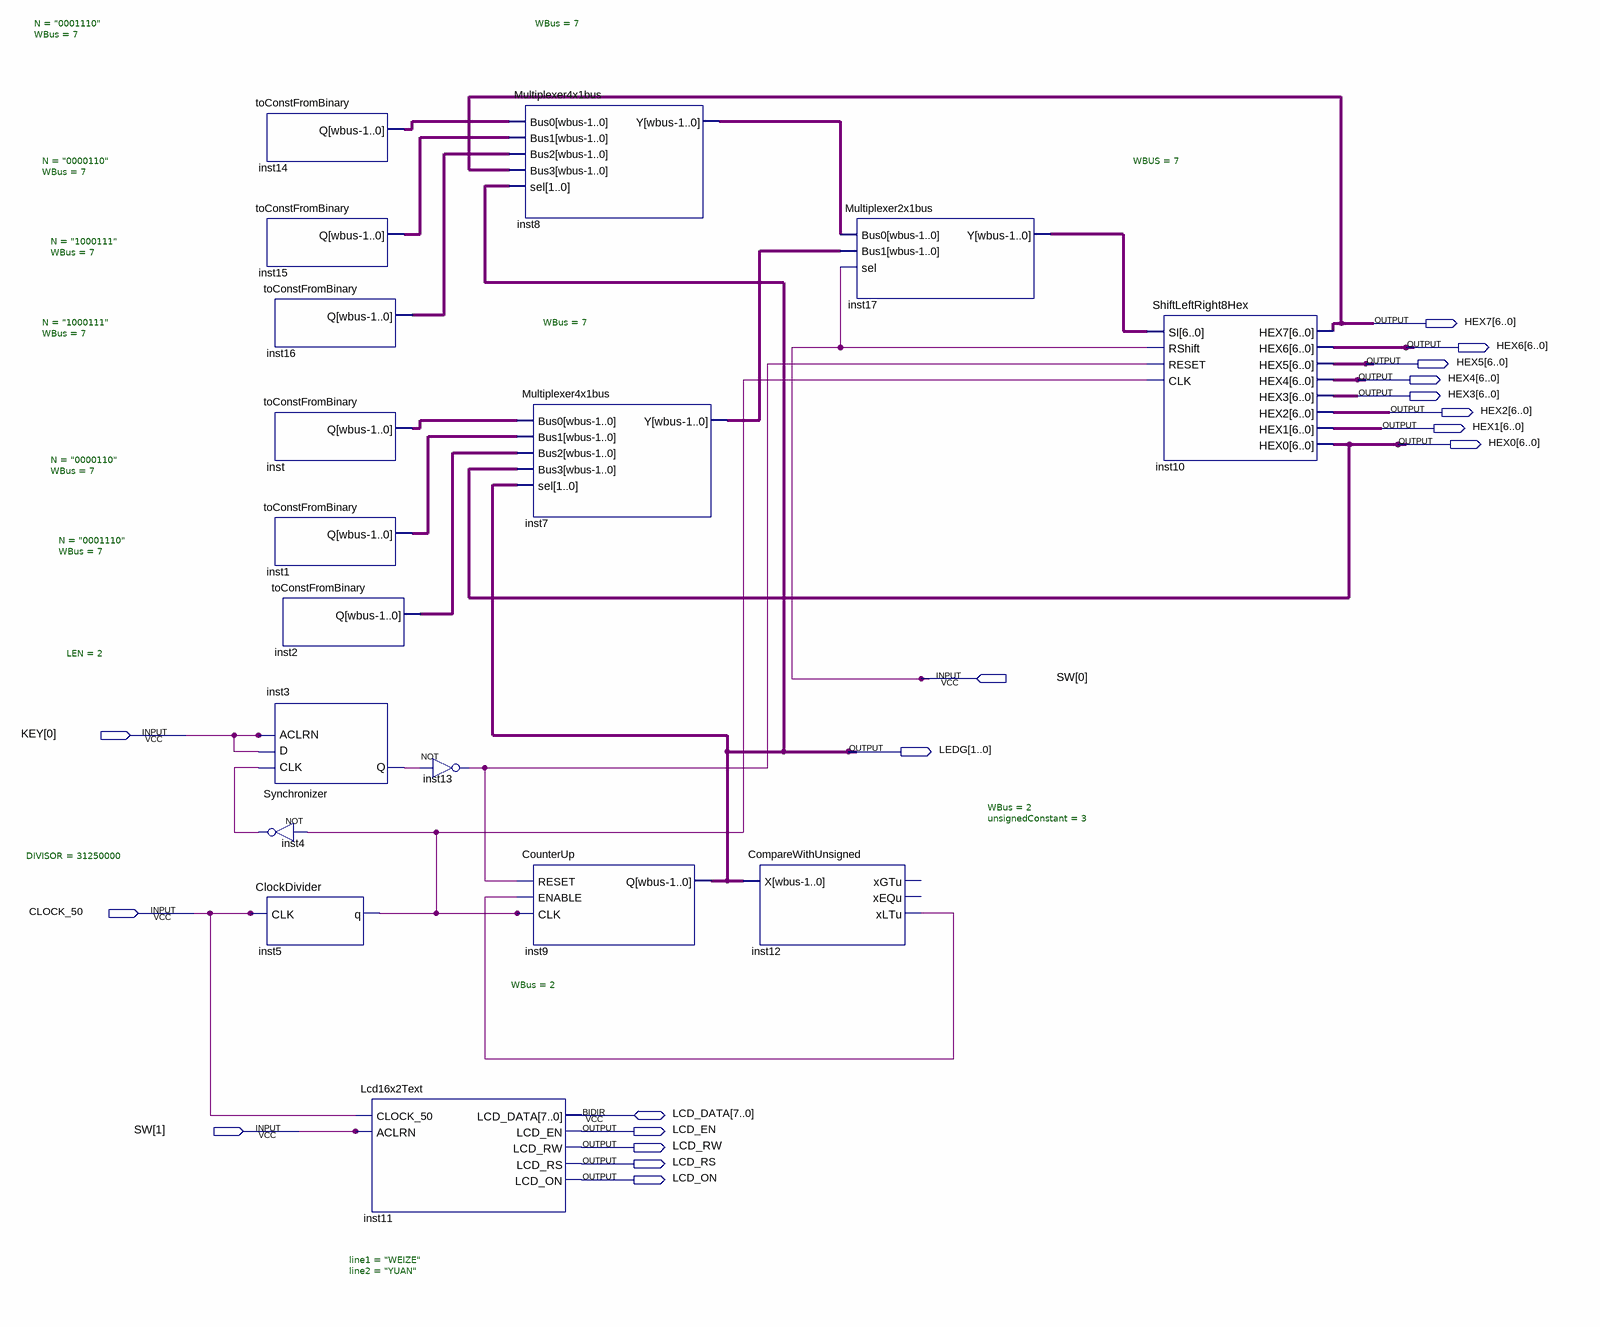
[diagram p0: schematic sheet]
// Quartus schematic mscd.bdf as structural Verilog: 17 symbols, 18 pins
module mscd (
  input  [1:0] SW,
  input  [0:0] KEY,
  input  CLOCK_50,
  inout  [7:0] LCD_DATA,
  output [6:0] HEX7,
  output [6:0] HEX6,
  output [6:0] HEX5,
  output [6:0] HEX4,
  output [6:0] HEX3,
  output [6:0] HEX2,
  output [6:0] HEX1,
  output [6:0] HEX0,
  output [1:0] LEDG,
  output LCD_EN,
  output LCD_RW,
  output LCD_RS,
  output LCD_ON
);

  wire inst3_q, inst4_out, inst5_q, inst12_xltu, inst13_out;
  wire [6:0] inst1_q, inst2_q, inst7_y, inst8_y, inst14_q, inst15_q, inst16_q, inst17_y, inst_q;

  toConstFromBinary #(.N("0001110"), .WBus(7)) inst14 (.Q(inst14_q));
  toConstFromBinary #(.N("0000110"), .WBus(7)) inst15 (.Q(inst15_q));
  toConstFromBinary #(.N("1000111"), .WBus(7)) inst16 (.Q(inst16_q));
  toConstFromBinary #(.N("1000111"), .WBus(7)) inst (.Q(inst_q));
  toConstFromBinary #(.N("0000110"), .WBus(7)) inst1 (.Q(inst1_q));
  toConstFromBinary #(.N("0001110"), .WBus(7)) inst2 (.Q(inst2_q));
  Synchronizer #(.LEN(2)) inst3 (.CLK(inst4_out), .D(KEY[0]), .ACLRN(KEY[0]), .Q(inst3_q));
  not inst4 (inst4_out, inst5_q);
  ClockDivider #(.DIVISOR(31250000)) inst5 (.CLK(CLOCK_50), .q(inst5_q));
  Lcd16x2Text #(.line1("WEIZE"), .line2("YUAN")) inst11 (
    .CLOCK_50(CLOCK_50), .ACLRN(SW[1]), .LCD_EN(LCD_EN), .LCD_RW(LCD_RW), .LCD_RS(LCD_RS), .LCD_ON(LCD_ON),
    .LCD_DATA(LCD_DATA));
  not inst13 (inst13_out, inst3_q);
  Multiplexer4x1bus #(.WBus(7)) inst8 (
    .Bus0(inst14_q), .Bus1(inst15_q), .Bus2(inst16_q), .Bus3(HEX7), .sel(LEDG), .Y(inst8_y));
  Multiplexer4x1bus #(.WBus(7)) inst7 (
    .Bus0(inst_q), .Bus1(inst1_q), .Bus2(inst2_q), .Bus3(HEX0), .sel(LEDG), .Y(inst7_y));
  CounterUp #(.WBus(2)) inst9 (.RESET(inst13_out), .ENABLE(inst12_xltu), .CLK(inst5_q), .Q(LEDG));
  CompareWithUnsigned #(.WBus(2), .unsignedConstant(3)) inst12 (.X(LEDG), .xLTu(inst12_xltu));  // open: xGTu, xEQu
  Multiplexer2x1bus #(.WBUS(7)) inst17 (.Bus0(inst8_y), .Bus1(inst7_y), .sel(SW[0]), .Y(inst17_y));
  ShiftLeftRight8Hex inst10 (
    .SI(inst17_y), .RShift(SW[0]), .RESET(inst13_out), .CLK(inst5_q), .HEX7(HEX7), .HEX6(HEX6), .HEX5(HEX5),
    .HEX4(HEX4), .HEX3(HEX3), .HEX2(HEX2), .HEX1(HEX1), .HEX0(HEX0));
endmodule
